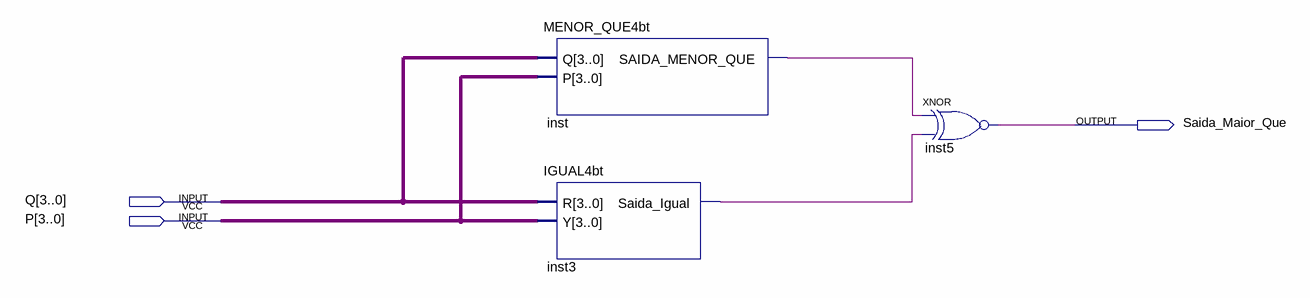
[diagram p0: schematic sheet]
// Quartus schematic MAIOR_QUE4bt.bdf as structural Verilog: 3 symbols, 3 pins
module MAIOR_QUE4bt (
  input  [3:0] Q,
  input  [3:0] P,
  output Saida_Maior_Que
);

  wire inst3_saida_igual, inst_saida_menor_que;

  MENOR_QUE4bt inst (.Q(Q), .P(P), .SAIDA_MENOR_QUE(inst_saida_menor_que));
  IGUAL4bt inst3 (.R(Q), .Y(P), .Saida_Igual(inst3_saida_igual));
  xnor inst5 (Saida_Maior_Que, inst_saida_menor_que, inst3_saida_igual);
endmodule
